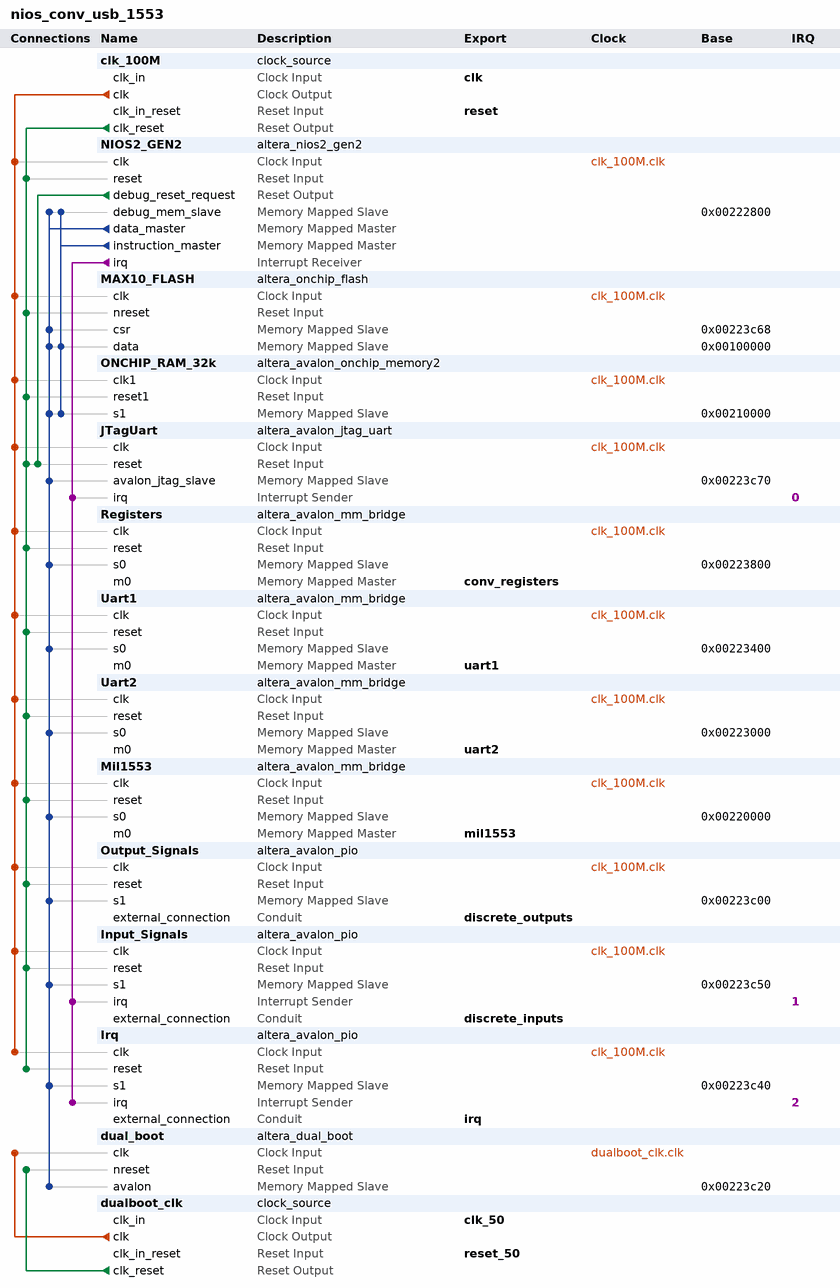
[diagram p0: system contents]
# Platform Designer (Qsys) system nios_conv_usb_1553, MAX 10 10M16SAE144I7G
# Parameters at their usual value, and those the tool derives, are not listed.
package require -exact qsys 18.1
create_system nios_conv_usb_1553
set_project_property DEVICE_FAMILY {MAX 10}
set_project_property DEVICE 10M16SAE144I7G

add_instance clk_100M clock_source 18.1
set_instance_parameter_value clk_100M clockFrequency 100000000
set_instance_parameter_value clk_100M resetSynchronousEdges BOTH

add_instance NIOS2_GEN2 altera_nios2_gen2 18.1
set_instance_parameter_value NIOS2_GEN2 dcache_size 2048
set_instance_parameter_value NIOS2_GEN2 debug_hwbreakpoint 4
set_instance_parameter_value NIOS2_GEN2 exceptionSlave ONCHIP_RAM_32k.s1
set_instance_parameter_value NIOS2_GEN2 icache_size 4096
set_instance_parameter_value NIOS2_GEN2 impl Tiny
set_instance_parameter_value NIOS2_GEN2 resetSlave MAX10_FLASH.data

add_instance MAX10_FLASH altera_onchip_flash 18.1
set_instance_parameter_value MAX10_FLASH CONFIGURATION_MODE {Dual Compressed Images}
set_instance_parameter_value MAX10_FLASH SECTOR_ACCESS_MODE {Read and write,Read and write,Read and write,Read and write,Read and write}
set_instance_parameter_value MAX10_FLASH initFlashContent false
set_instance_parameter_value MAX10_FLASH initializationFileName D:/_Projects/tail_gnss/sw/btg_app_20mhz/mem_init/MAX10_FLASH.hex
set_instance_parameter_value MAX10_FLASH useNonDefaultInitFile false

add_instance ONCHIP_RAM_32k altera_avalon_onchip_memory2 18.1
set_instance_parameter_value ONCHIP_RAM_32k dataWidth 32
set_instance_parameter_value ONCHIP_RAM_32k dualPort false
set_instance_parameter_value ONCHIP_RAM_32k initMemContent false
set_instance_parameter_value ONCHIP_RAM_32k initializationFileName D:/_Projects/tail_gnss/sw/btg_app/mem_init/nios_tail_gnss_ONCHIP_RAM_32k.hex
set_instance_parameter_value ONCHIP_RAM_32k memorySize 8192

add_instance JTagUart altera_avalon_jtag_uart 18.1
set_instance_parameter_value JTagUart simInteractiveOptions NO_INTERACTIVE_WINDOWS

add_instance Registers altera_avalon_mm_bridge 18.1
set_instance_parameter_value Registers ADDRESS_UNITS WORDS
set_instance_parameter_value Registers ADDRESS_WIDTH 8
set_instance_parameter_value Registers DATA_WIDTH 16
set_instance_parameter_value Registers MAX_PENDING_RESPONSES 1
set_instance_parameter_value Registers USE_AUTO_ADDRESS_WIDTH 1

add_instance Uart1 altera_avalon_mm_bridge 18.1
set_instance_parameter_value Uart1 ADDRESS_UNITS WORDS
set_instance_parameter_value Uart1 ADDRESS_WIDTH 8
set_instance_parameter_value Uart1 DATA_WIDTH 16
set_instance_parameter_value Uart1 MAX_PENDING_RESPONSES 1
set_instance_parameter_value Uart1 USE_AUTO_ADDRESS_WIDTH 1

add_instance Uart2 altera_avalon_mm_bridge 18.1
set_instance_parameter_value Uart2 ADDRESS_UNITS WORDS
set_instance_parameter_value Uart2 ADDRESS_WIDTH 8
set_instance_parameter_value Uart2 DATA_WIDTH 16
set_instance_parameter_value Uart2 MAX_PENDING_RESPONSES 1
set_instance_parameter_value Uart2 USE_AUTO_ADDRESS_WIDTH 1

add_instance Mil1553 altera_avalon_mm_bridge 18.1
set_instance_parameter_value Mil1553 ADDRESS_UNITS WORDS
set_instance_parameter_value Mil1553 ADDRESS_WIDTH 12
set_instance_parameter_value Mil1553 DATA_WIDTH 16
set_instance_parameter_value Mil1553 MAX_PENDING_RESPONSES 1
set_instance_parameter_value Mil1553 USE_AUTO_ADDRESS_WIDTH 0

add_instance Output_Signals altera_avalon_pio 18.1
set_instance_parameter_value Output_Signals bitModifyingOutReg true
set_instance_parameter_value Output_Signals direction Output
set_instance_parameter_value Output_Signals width 16

add_instance Input_Signals altera_avalon_pio 18.1
set_instance_parameter_value Input_Signals bitClearingEdgeCapReg true
set_instance_parameter_value Input_Signals captureEdge true
set_instance_parameter_value Input_Signals direction Input
set_instance_parameter_value Input_Signals generateIRQ true
set_instance_parameter_value Input_Signals irqType EDGE
set_instance_parameter_value Input_Signals simDoTestBenchWiring true
set_instance_parameter_value Input_Signals width 16

add_instance Irq altera_avalon_pio 18.1
set_instance_parameter_value Irq bitClearingEdgeCapReg true
set_instance_parameter_value Irq captureEdge true
set_instance_parameter_value Irq direction Input
set_instance_parameter_value Irq generateIRQ true
set_instance_parameter_value Irq irqType EDGE
set_instance_parameter_value Irq simDoTestBenchWiring true
set_instance_parameter_value Irq width 16

add_instance dual_boot altera_dual_boot 18.1
set_instance_parameter_value dual_boot CLOCK_FREQUENCY 50.0

add_instance dualboot_clk clock_source 18.1
set_instance_parameter_value dualboot_clk clockFrequency 50000000
set_instance_parameter_value dualboot_clk resetSynchronousEdges BOTH

# connections
add_connection clk_100M.clk Input_Signals.clk clock
add_connection clk_100M.clk Irq.clk clock
add_connection clk_100M.clk JTagUart.clk clock
add_connection clk_100M.clk MAX10_FLASH.clk clock
add_connection clk_100M.clk Mil1553.clk clock
add_connection clk_100M.clk NIOS2_GEN2.clk clock
add_connection clk_100M.clk ONCHIP_RAM_32k.clk1 clock
add_connection clk_100M.clk Output_Signals.clk clock
add_connection clk_100M.clk Registers.clk clock
add_connection clk_100M.clk Uart1.clk clock
add_connection clk_100M.clk Uart2.clk clock
add_connection dualboot_clk.clk dual_boot.clk clock
add_connection clk_100M.clk_reset Input_Signals.reset reset
add_connection clk_100M.clk_reset Irq.reset reset
add_connection clk_100M.clk_reset JTagUart.reset reset
add_connection clk_100M.clk_reset MAX10_FLASH.nreset reset
add_connection clk_100M.clk_reset Mil1553.reset reset
add_connection clk_100M.clk_reset NIOS2_GEN2.reset reset
add_connection clk_100M.clk_reset ONCHIP_RAM_32k.reset1 reset
add_connection clk_100M.clk_reset Output_Signals.reset reset
add_connection clk_100M.clk_reset Registers.reset reset
add_connection clk_100M.clk_reset Uart1.reset reset
add_connection clk_100M.clk_reset Uart2.reset reset
add_connection dualboot_clk.clk_reset dual_boot.nreset reset
add_connection NIOS2_GEN2.debug_reset_request JTagUart.reset reset
add_connection NIOS2_GEN2.data_master dual_boot.avalon avalon
set_connection_parameter_value NIOS2_GEN2.data_master/dual_boot.avalon baseAddress 0x00223c20
add_connection NIOS2_GEN2.data_master Input_Signals.s1 avalon
set_connection_parameter_value NIOS2_GEN2.data_master/Input_Signals.s1 baseAddress 0x00223c50
add_connection NIOS2_GEN2.data_master Irq.s1 avalon
set_connection_parameter_value NIOS2_GEN2.data_master/Irq.s1 baseAddress 0x00223c40
add_connection NIOS2_GEN2.data_master JTagUart.avalon_jtag_slave avalon
set_connection_parameter_value NIOS2_GEN2.data_master/JTagUart.avalon_jtag_slave baseAddress 0x00223c70
add_connection NIOS2_GEN2.data_master MAX10_FLASH.csr avalon
set_connection_parameter_value NIOS2_GEN2.data_master/MAX10_FLASH.csr baseAddress 0x00223c68
add_connection NIOS2_GEN2.data_master MAX10_FLASH.data avalon
set_connection_parameter_value NIOS2_GEN2.data_master/MAX10_FLASH.data baseAddress 0x00100000
add_connection NIOS2_GEN2.data_master Mil1553.s0 avalon
set_connection_parameter_value NIOS2_GEN2.data_master/Mil1553.s0 baseAddress 0x00220000
add_connection NIOS2_GEN2.data_master NIOS2_GEN2.debug_mem_slave avalon
set_connection_parameter_value NIOS2_GEN2.data_master/NIOS2_GEN2.debug_mem_slave baseAddress 0x00222800
add_connection NIOS2_GEN2.data_master ONCHIP_RAM_32k.s1 avalon
set_connection_parameter_value NIOS2_GEN2.data_master/ONCHIP_RAM_32k.s1 baseAddress 0x00210000
add_connection NIOS2_GEN2.data_master Output_Signals.s1 avalon
set_connection_parameter_value NIOS2_GEN2.data_master/Output_Signals.s1 baseAddress 0x00223c00
add_connection NIOS2_GEN2.data_master Registers.s0 avalon
set_connection_parameter_value NIOS2_GEN2.data_master/Registers.s0 baseAddress 0x00223800
add_connection NIOS2_GEN2.data_master Uart1.s0 avalon
set_connection_parameter_value NIOS2_GEN2.data_master/Uart1.s0 baseAddress 0x00223400
add_connection NIOS2_GEN2.data_master Uart2.s0 avalon
set_connection_parameter_value NIOS2_GEN2.data_master/Uart2.s0 baseAddress 0x00223000
add_connection NIOS2_GEN2.instruction_master MAX10_FLASH.data avalon
set_connection_parameter_value NIOS2_GEN2.instruction_master/MAX10_FLASH.data baseAddress 0x00100000
add_connection NIOS2_GEN2.instruction_master NIOS2_GEN2.debug_mem_slave avalon
set_connection_parameter_value NIOS2_GEN2.instruction_master/NIOS2_GEN2.debug_mem_slave baseAddress 0x00222800
add_connection NIOS2_GEN2.instruction_master ONCHIP_RAM_32k.s1 avalon
set_connection_parameter_value NIOS2_GEN2.instruction_master/ONCHIP_RAM_32k.s1 baseAddress 0x00210000
add_connection NIOS2_GEN2.irq Input_Signals.irq interrupt
set_connection_parameter_value NIOS2_GEN2.irq/Input_Signals.irq irqNumber 1
add_connection NIOS2_GEN2.irq Irq.irq interrupt
set_connection_parameter_value NIOS2_GEN2.irq/Irq.irq irqNumber 2
add_connection NIOS2_GEN2.irq JTagUart.irq interrupt
set_connection_parameter_value NIOS2_GEN2.irq/JTagUart.irq irqNumber 0

# exported interfaces
add_interface clk clock sink
set_interface_property clk EXPORT_OF clk_100M.clk_in
add_interface clk_50 clock sink
set_interface_property clk_50 EXPORT_OF dualboot_clk.clk_in
add_interface conv_registers avalon master
set_interface_property conv_registers EXPORT_OF Registers.m0
add_interface discrete_inputs conduit end
set_interface_property discrete_inputs EXPORT_OF Input_Signals.external_connection
add_interface discrete_outputs conduit end
set_interface_property discrete_outputs EXPORT_OF Output_Signals.external_connection
add_interface irq conduit end
set_interface_property irq EXPORT_OF Irq.external_connection
add_interface mil1553 avalon master
set_interface_property mil1553 EXPORT_OF Mil1553.m0
add_interface reset reset sink
set_interface_property reset EXPORT_OF clk_100M.clk_in_reset
add_interface reset_50 reset sink
set_interface_property reset_50 EXPORT_OF dualboot_clk.clk_in_reset
add_interface uart1 avalon master
set_interface_property uart1 EXPORT_OF Uart1.m0
add_interface uart2 avalon master
set_interface_property uart2 EXPORT_OF Uart2.m0

set_interconnect_requirement {$system} qsys_mm.clockCrossingAdapter HANDSHAKE
set_interconnect_requirement {$system} qsys_mm.enableEccProtection FALSE
set_interconnect_requirement {$system} qsys_mm.insertDefaultSlave FALSE
set_interconnect_requirement {$system} qsys_mm.maxAdditionalLatency 1

save_system nios_conv_usb_1553.qsys
